# EAGLE design U WE BOX (EAGLE 9.6.2)

## Sheet 1 of 6: Power Supply Unit
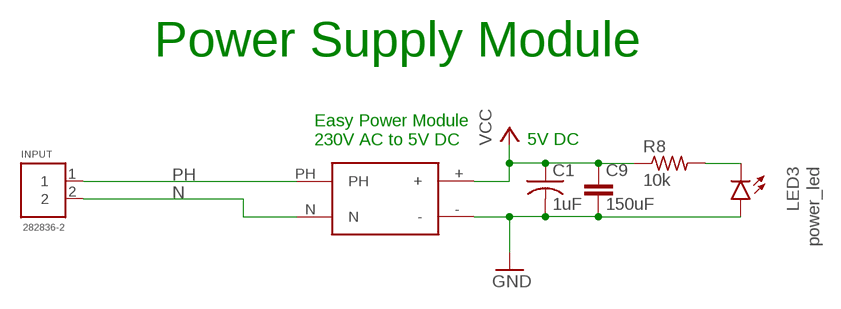
[diagram p0: schematic, sheet 1]

### Parts
C1  1uF  C-USC1206K  [C1206K]
C9  150uF  C5/5  [C5B5]
INPUT  282836-2  [CONN_282836-2]
LED3  power_led  LEDCHIPLED_1206  [CHIPLED_1206]
R8  10k  R-US_M1206  [M1206]
U2  AC/DCCONVERTER  [ACDC]

### Nets
GND: C1.2 C9.2 LED3.A U2.- ; also sheet 2,3,4,5,6
N: INPUT.2 U2.N ; also sheet 5
N$2: LED3.C R8.2
PH: INPUT.1 U2.PH ; also sheet 5
VCC: C1.1 C9.1 R8.1 U2.+ ; also sheet 2,3,4,5,6

### Notes on the sheet
- Power Supply Module
- Easy Power Module
  230V AC to 5V DC
- 5V DC

## Sheet 2 of 6: Indication LEDs
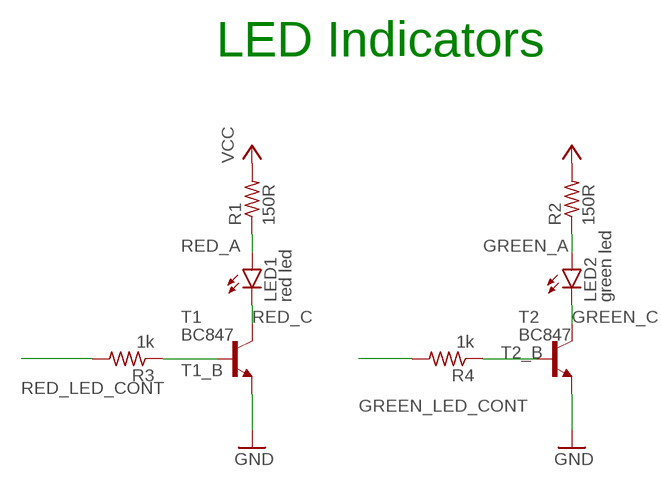
[diagram p1: schematic, sheet 2]

### Parts
LED1  red led  LEDCHIPLED_1206  [CHIPLED_1206]
LED2  green led  LEDCHIPLED_1206  [CHIPLED_1206]
R1  150R  R-US_R1206  [R1206]
R2  150R  R-US_R1206  [R1206]
R3  1k  R-US_R1206  [R1206]
R4  1k  R-US_R1206  [R1206]
T1  BC847  [SOT23]
T2  BC847  [SOT23]

### Nets
GND: T1.2(E) T2.2(E) ; also sheet 1,3,4,5,6
GREEN_A: LED2.A R2.1
GREEN_C: LED2.C T2.3(C)
GREEN_LED_CONT: R4.2 ; also sheet 6
RED_A: LED1.A R1.1
RED_C: LED1.C T1.3(C)
RED_LED_CONT: R3.2 ; also sheet 6
T1_B: R3.1 T1.1(B)
T2_B: R4.1 T2.1(B)
VCC: R1.2 R2.2 ; also sheet 1,3,4,5,6

### Notes on the sheet
- LED Indicators

## Sheet 3 of 6: Hooter System
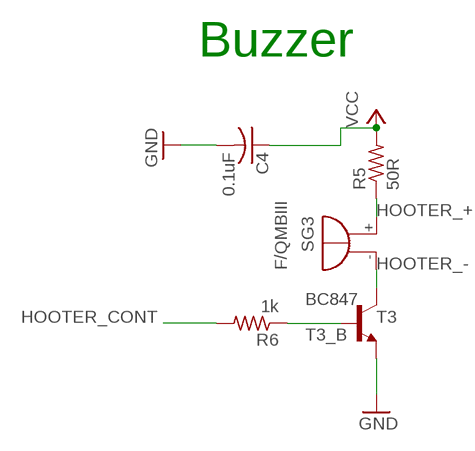
[diagram p2: schematic, sheet 3]

### Parts
C4  0.1uF  C-USC1206K  [C1206K]
R5  50R  R-US_R1206  [R1206]
R6  1k  R-US_R1206  [R1206]
SG3  F/QMBIII  [F/QMBIII]
T3  BC847  [SOT23]

### Nets
GND: C4.2 T3.2(E) ; also sheet 1,2,4,5,6
HOOTER_+: R5.1 SG3.+(-)
HOOTER_-: SG3.-(+) T3.3(C)
HOOTER_CONT: R6.2 ; also sheet 6
T3_B: R6.1 T3.1(B)
VCC: C4.1 R5.2 ; also sheet 1,2,4,5,6

### Notes on the sheet
- Buzzer

## Sheet 4 of 6: Pushbutton
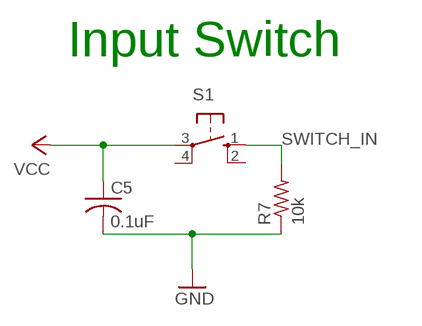
[diagram p3: schematic, sheet 4]

### Parts
C5  0.1uF  C-USC1206K  [C1206K]
R7  10k  R-US_R1206  [R1206]
S1  40-XX  [B3F-40XX]

### Nets
GND: C5.2 R7.1 ; also sheet 1,2,3,5,6
SWITCH_IN: R7.2 S1.1(S) ; also sheet 6
VCC: C5.1 S1.3(P) ; also sheet 1,2,3,5,6
Unconnected: S1.2(S1) S1.4(P1)

### Notes on the sheet
- Input Switch

## Sheet 5 of 6: Relay and Limit Switch
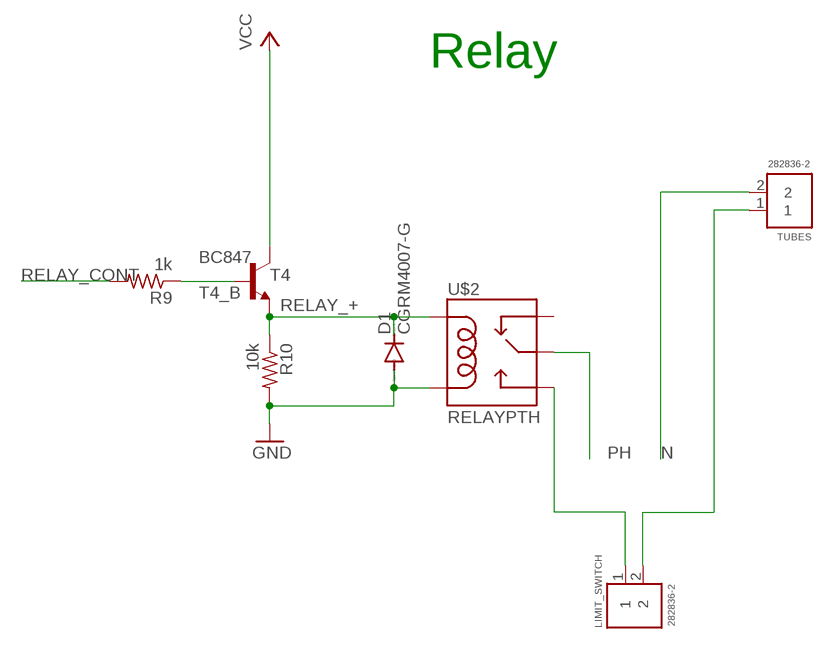
[diagram p4: schematic, sheet 5]

### Parts
D1  CGRM4007-G  [SOD-123_MINI-SMA]
LIMIT_SWITCH  282836-2  [CONN_282836-2]
R9  1k  R-US_R1206  [R1206]
R10  10k  R-US_R1206  [R1206]
T4  BC847  [SOT23]
TUBES  282836-2  [CONN_282836-2]
U$2  RELAYPTH  [SRD-05VDC-SL-C]

### Nets
GND: D1.A R10.2 U$2.COIL0 ; also sheet 1,2,3,4,6
N: TUBES.2 ; also sheet 1
PH: U$2.SWCOMMON ; also sheet 1
PH_RELAY: LIMIT_SWITCH.1 U$2.SWOPEN
RELAY_+: D1.C R10.1 T4.2(E) U$2.COIL1
RELAY_CONT: R9.2 ; also sheet 6
T4_B: R9.1 T4.1(B)
TUBE_N: LIMIT_SWITCH.2 TUBES.1
VCC: T4.3(C) ; also sheet 1,2,3,4,6
Unconnected: U$2.SWCLOSED(SWCLOSE)

### Notes on the sheet
- Relay

## Sheet 6 of 6: controller
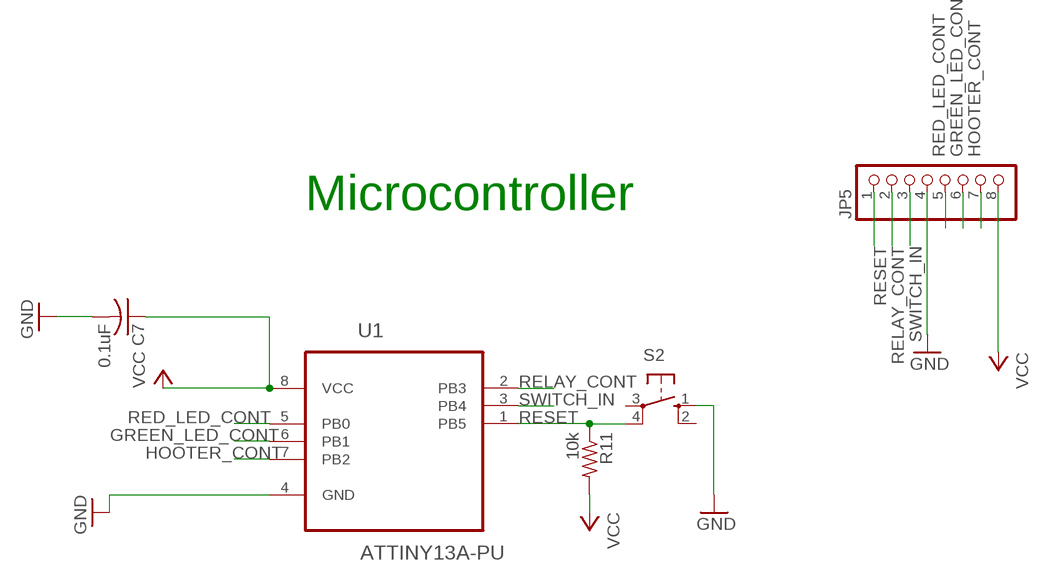
[diagram p5: schematic, sheet 6]

### Parts
C7  0.1uF  C-USC1206K  [C1206K]
JP5  PINHD-1X8  [1X08]
R11  10k  R-US_R1206  [R1206]
S2  10-XX  [B3F-10XX]
U1  ATTINY13A-PU  [DIP254P762X533-8]

### Nets
GND: C7.2 JP5.4 S2.1(S) U1.4(GND) ; also sheet 1,2,3,4,5
GREEN_LED_CONT: JP5.6 U1.6(PB1) ; also sheet 2
HOOTER_CONT: JP5.7 U1.7(PB2) ; also sheet 3
RED_LED_CONT: JP5.5 U1.5(PB0) ; also sheet 2
RELAY_CONT: JP5.2 U1.2(PB3) ; also sheet 5
RESET: JP5.1 R11.1 S2.4(P1) U1.1(PB5)
SWITCH_IN: JP5.3 U1.3(PB4) ; also sheet 4
VCC: C7.1 JP5.8 R11.2 U1.8(VCC) ; also sheet 1,2,3,4,5
Unconnected: S2.2(S1) S2.3(P)

### Notes on the sheet
- Microcontroller

## Library data of the parts
C1 C4 C5 C7 = rcl:C-US: CAPACITOR, American symbol; SPICEPREFIX: C
C9 = capacitor-wima:C: CAPACITOR naming: grid - package width
D1 = diode:CGRM400*-G: Molded plasitc,JEDEC SOD-123/Mini SMA Source: Comchip CGRM4001-G.pdf
INPUT LIMIT_SWITCH TUBES = 282836-2:282836-2: TERM BLOCK 2POS SIDE ENTRY 5MM Check prices <https://pricing.snapeda.com/parts/282836-2/TE%20Connectivity/view-part?ref=eda>; AVAILABILITY: Good; CENTERLINE_PITCH: 5 mm[.197 in]; COMMENT: 282836-2; DESCRIPTION: Connector, Terminal Block; Wire Receptacle; 2 Pos.; 16-30 AWG; 0.197 in. CL; Sid; EU_ROHS_COMPLIANCE: Compliant with Exemptions; MF: TE Connectivity; MP: 282836-2; NUMBER_OF_POSITIONS: 2; PACKAGE: None; PRICE: None; PURCHASE-URL: https://pricing.snapeda.com/search/part/282836-2/?ref=eda
JP5 = pinhead:PINHD-1X8: PIN HEADER
LED1-LED3 = led:LED: LED OSRAM: - CHIPLED LG R971, LG N971, LY N971, LG Q971, LY Q971, LO R971, LY R971 LH N974, LH R974 LS Q976, LO Q976, LY Q976 LO Q996 - Hyper CHIPLED LW Q18S LB Q993, LB Q99A, LB R99A - SideLED LS A670, LO A670, LY A670, LG A670, LP A670 LB A673, LV A673, LT A673, LW A673 LH A674 LY A675 LS A676, LA A676, LO A676, LY A676, LW A676 LS A679, LY A679, LG A679 - Hyper Micro SIDELED® LS Y876, LA Y876, LO Y876, LY Y876 LT Y87S - SmartLED LW L88C, LW L88S LB L89C, LB L89S, LG L890 LS L89K, LO L89K, LY L89K LS L896, LA L896, LO L896, LY L896 - TOPLED LS T670, LO T670, LY T670, LG T670, LP T670 LSG T670, LSP T670, LSY T670, LOP T670, LYG T670 LG T671, LOG T671, LSG T671 LB T673, LV T673, LT T673, LW T673 LH T674 LS T676, LA T676, LO T676, LY T676, LB T676, LH T676, LSB T676, LW T676 LB T67C, LV T67C, LT T67C, LS T67K, LO T67K, LY T67K, LW E67C LS E67B, LA E67B, LO E67B, LY E67B, LB E67C, LV E67C, LT E67C LW T67C LS T679, LY T679, LG T679 LS T770, LO T770, LY T770, LG T770, LP T770 LB T773, LV T773, LT T773, LW T773 LH T774 LS E675, LA E675, LY E675, LS T675 LS T776, LA T776, LO T776, LY T776, LB T776 LHGB T686 LT T68C, LB T68C - Hyper Mini TOPLED® LB M676 - Mini TOPLED Santana® LG M470 LS M47K, LO M47K, LY M47K Source: http://www.osram.convergy.de LUXEON: - LUMILED® LXK2-PW12-R00, LXK2-PW12-S00, LXK2-PW14-U00, LXK2-PW14-V00 LXK2-PM12-R00, LXK2-PM12-S00, LXK2-PM14-U00 LXK2-PE12-Q00, LXK2-PE12-R00, LXK2-PE12-S00, LXK2-PE14-T00, LXK2-PE14-U00 LXK2-PB12-K00, LXK2-PB12-L00, LXK2-PB12-M00, LXK2-PB14-N00, LXK2-PB14-P00, LXK2-PB14-Q00 LXK2-PR12-L00, LXK2-PR12-M00, LXK2-PR14-Q00, LXK2-PR14-R00 LXK2-PD12-Q00, LXK2-PD12-R00, LXK2-PD12-S00 LXK2-PH12-R00, LXK2-PH12-S00 LXK2-PL12-P00, LXK2-PL12-Q00, LXK2-PL12-R00 Source: www.luxeon.com KINGBRIGHT: KA-3528ASYC Source: www.kingbright.com
R1-R11 = rcl:R-US_: RESISTOR, American symbol; SPICEPREFIX: R
S1 = switch-omron:40-XX: OMRON SWITCH; MF: OMRON COMPONENTS USA; MPN: B3F-4000; OC_FARNELL: 176434; OC_NEWARK: 36K3105
S2 = switch-omron:10-XX: OMRON SWITCH; MPN: B3F-1000; OC_FARNELL: 176432; OC_NEWARK: 36M3542
SG3 = buzzer:F/QMBIII: BUZZER Source: Buerklin; OC_FARNELL: unknown; OC_NEWARK: unknown
T1-T4 = transistor:BC847: NPN TRANSISTOR
U1 = ATTINY13A-PU:ATTINY13A-PU: 8-bit Microcontroller with 1K Bytes In-System Programmable Flash Check prices <https://pricing.snapeda.com/parts/ATTINY13A-PU/Microchip/view-part?ref=eda>; AVAILABILITY: Good; DESCRIPTION: AVR AVR® ATtiny Microcontroller IC 8-Bit 20MHz 1KB (512 x 16) FLASH 8-PDIP; MF: Microchip; MP: ATTINY13A-PU; PACKAGE: PDIP-8 Microchip; PRICE: None; PURCHASE-URL: https://pricing.snapeda.com/search/part/ATTINY13A-PU/?ref=eda
U2 = ACDC_5V:AC/DCCONVERTER
U$2 = SRD-05VDC-SL-C:RELAY: SPDT relay (COM-00101)

## Net classes
0 default: width 0.152 mm, clearance 0.152 mm

## Board
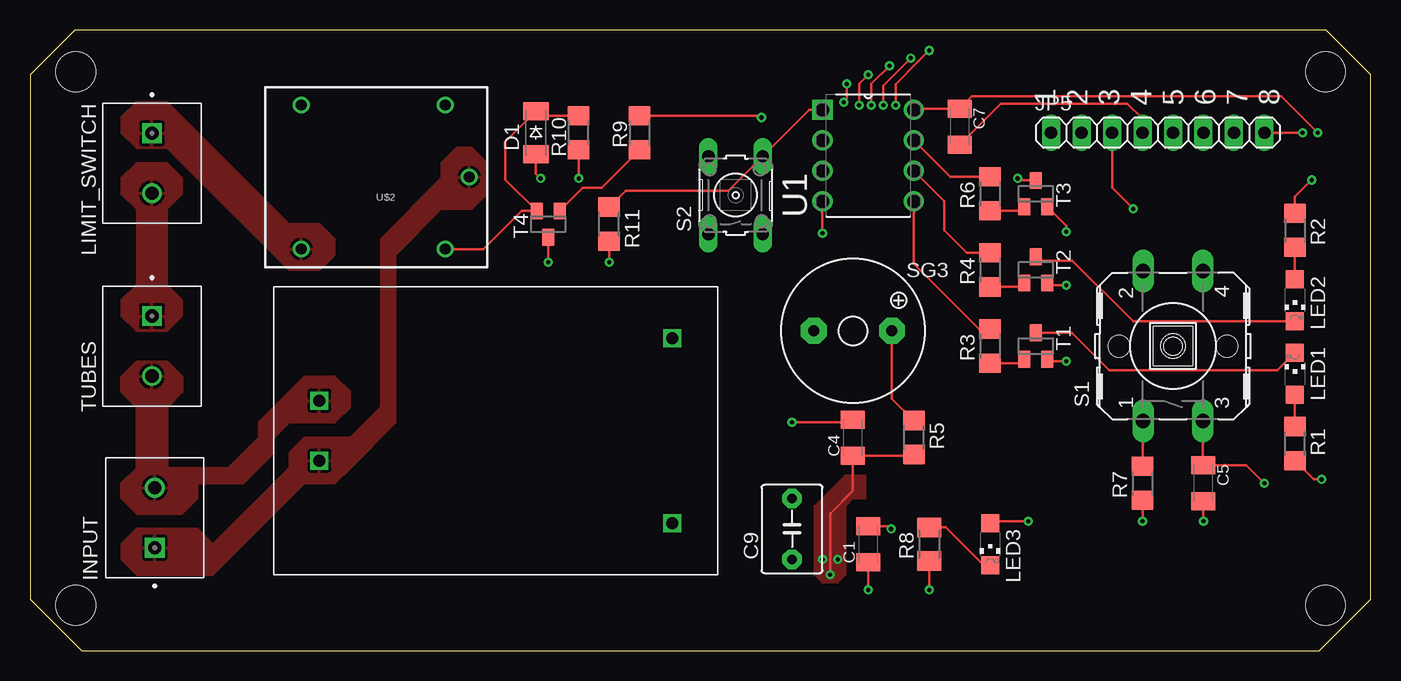
[diagram p6: board, top side]
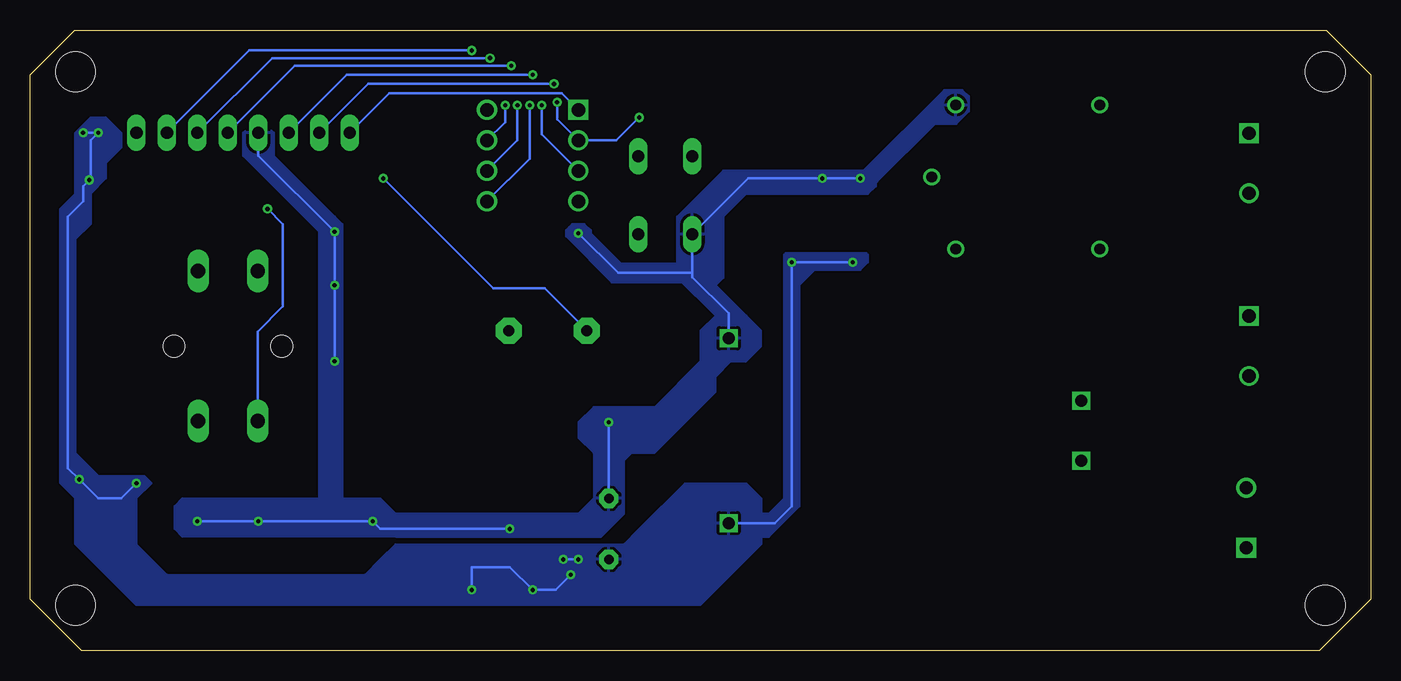
[diagram p7: board, bottom side, seen from below]

Size 111.74 x 51.74 mm. Coordinates in mm from the lower left corner, seen from the top.
Outline: 0,48.01 0,4.32 4.32,0 107.44,0 111.74,4.3 111.74,48.03 108.03,51.74 3.73,51.74 0,48.01
Copper layers (1*16): Top 0.035mm / dielectric 1.5mm / Bottom 0.035mm
Design rules "default": minimum track width 6mil, minimum drill 0.35mm, track to track 6mil, track to pad 6mil, pad to pad 6mil, via to via 6mil, smd to smd 6mil, copper to edge 40mil, drill to drill 6mil, minimum pad ring 10mil, minimum via ring 8mil, stop-mask expansion 4mil, vias tented up to drill 0mil, thermal gap 10mil
Holes 3.3 mm at 3.81,48.26 107.95,48.26 107.95,3.81 3.81,3.81

### Footprints (pad centres in the part's own frame; a part is rotated, then mirrored left to right if it is on the bottom)
C1206K = smd 1.5 x 2: 1 -1.5,0; 2 1.5,0
C5B5 = drill 0.813 pad 1.6 octagon: 1 -2.54,0; 2 2.54,0
SOD-123_MINI-SMA = smd 1.5 x 2.1: A 1.8,0; C -1.8,0
CONN_282836-2 = drill 1.1 square: 1 -2.5,0 | drill 1.1: 2 2.5,0
1X08 = drill 1.016 long: 1 -8.89,0; 2 -6.35,0; 3 -3.81,0; 4 -1.27,0; 5 1.27,0; 6 3.81,0; 7 6.35,0; 8 8.89,0
CHIPLED_1206 = smd 1.5 x 1.5: A 0,-1.75; C 0,1.75
R1206 = smd 1.6 x 1.803: 1 -1.422,0; 2 1.422,0
M1206 = smd 1.6 x 2: 1 -1.4,0; 2 1.4,0
B3F-40XX = drill 1.194 long: 1 -6.248,2.489; 2 6.248,2.489; 3 -6.248,-2.489; 4 6.248,-2.489 | hole 1.803: 0,-4.496; 0,4.496
B3F-10XX = drill 1.016 long: 1 -3.251,2.261; 2 3.251,2.261; 3 -3.251,-2.261; 4 3.251,-2.261
F/QMBIII = drill 0.914 pad 2.159 octagon: + 3.251,0; - -3.251,0
SOT23 = smd 1 x 1.4: 1 -0.95,-1.1; 2 0.95,-1.1; 3 0,1.1
DIP254P762X533-8 = drill 1.118 square: 1 -7.62,7.62 | drill 1.118: 2 -7.62,5.08; 3 -7.62,2.54; 4 -7.62,0; 5 0,0; 6 0,2.54; 7 0,5.08; 8 0,7.62
ACDC = drill 1 square: + 33.2,4.3; - 33.2,19.7; N 3.8,14.5; PH 3.8,9.5
SRD-05VDC-SL-C = drill 0.9: COIL0 -5.39,-6.12; COIL1 -5.39,5.88; SWCLOSED 6.61,-6.12; SWCOMMON -7.39,-0.12; SWOPEN 6.61,5.88

### Placement (x,y rotation side)
C1  69.85,8.89 90 top
C4  68.58,17.78 90 top
C5  97.79,13.97 270 top
C7  77.47,43.69 270 top
C9  63.5,10.16 90 top
D1  42.16,43.18 270 top
INPUT  10.39,11.1 90 top
JP5  93.98,43.18 0 top
LED1  105.41,23.11 0 top
LED2  105.41,29.21 180 top
LED3  80.01,8.89 180 top
LIMIT_SWITCH  10.16,40.64 270 top
R1  105.41,17.27 270 top
R2  105.41,35.05 90 top
R3  80.01,25.4 90 top
R4  80.01,31.75 90 top
R5  73.66,17.78 270 top
R6  80.01,38.1 90 top
R7  92.71,13.97 90 top
R8  74.93,8.89 90 top
R9  50.8,43.18 90 top
R10  45.72,43.18 270 top
R11  48.26,35.56 270 top
S1  95.25,25.4 90 top
S2  58.8,37.97 90 top
SG3  68.58,26.67 0 top
T1  83.82,25.4 0 top
T2  83.82,31.75 0 top
T3  83.82,38.1 0 top
T4  43.18,35.56 180 top
TUBES  10.16,25.4 270 top
U1  73.66,37.47 0 top
U2  20.32,6.35 0 top
U$2  29.21,39.37 180 top

### Tracks (layer width: path | path; a pad name or v marks a point on that pad's centre or on a via)
GND  (via drill 0.35)
  Top 0.203: R7.1 v92.71,10.79 | v97.79,10.79 C5.2 | LED3.A 80.17,10.79 v83.19,10.79 | C1.2 71.53,10.39 v71.75,10.16 | C4.2 68.35,19.05 v63.5,19.05 | T3.2 86.36,35.41 v86.36,34.92 | v86.36,30.48 84.94,30.48 T2.2 | T1.2 84.94,24.13 v86.36,24.13 | C7.2 80.88,45.59 91.44,45.59 92.71,44.32 JP5.4 | v45.72,39.37 R10.2 | v42.55,39.37 42.16,39.75 D1.A | U1.4 v66.04,34.8
  Bottom 0.203: v97.79,10.79 v92.71,10.79 v83.19,10.79 82.55,10.16 v71.75,10.16 | v63.5,19.05 C9.2 | v86.36,24.13 v86.36,30.48 v86.36,34.92 92.71,41.27 JP5.4 | U2.- 53.52,28.12 56.54,31.14 56.54,31.5 | 56.54,31.5 S2.1 51.89,39.37 v45.72,39.37 v42.55,39.37 | v66.04,34.8 62.74,31.5 56.54,31.5
  pour Bottom: 52.07,27.94 54.61,27.94 55.88,26.67 55.88,25.4 55.88,24.13 59.69,20.32 64.77,20.32 66.04,19.05 66.04,17.78 64.77,16.51 59.69,16.51 54.61,21.59 54.61,22.86 53.34,24.13 52.07,24.13 50.8,25.4 50.8,26.67
  pour Bottom: 62.23,17.78 63.5,17.78 64.77,16.51 64.77,12.7 66.04,11.43 81.28,11.43 81.92,10.79 81.92,10.16 81.28,9.53 64.14,9.53 62.23,11.43 62.23,15.88 61.59,16.51 61.59,17.14
  pour Bottom: 81.28,11.43 80.64,10.79 80.64,10.16 81.28,9.53 99.06,9.53 99.69,10.16 99.69,12.06 99.06,12.7 82.55,12.7
  pour Bottom: 87.63,11.43 86.36,11.43 85.72,12.06 85.72,35.56 86.36,36.2 87,36.2 87.63,35.56
  pour Bottom: 92.08,43.81 93.34,43.81 93.98,43.18 93.98,41.27 87.63,34.92 87,34.92 86.36,34.92 85.72,35.56 86.36,36.2 91.44,41.27 91.44,41.91 91.44,43.18
  pour Bottom: 52.07,27.94 52.7,27.3 53.98,27.3 54.61,27.94 57.78,31.11 57.78,36.2 53.98,40.01 41.91,40.01 41.27,39.37 41.27,38.73 41.91,38.1 52.07,38.1 55.88,34.29 55.88,31.75
  pour Bottom: 53.98,36.2 53.98,31.11 54.61,30.48 55.24,30.48 55.88,31.11 55.88,35.56 55.24,36.2
  pour Bottom: 56.64,32.26 56.64,31.5 57.4,30.73 63.25,30.73 67.06,34.54 67.06,35.05 66.8,35.31 66.55,35.56 65.53,35.56 65.02,35.05 65.02,34.8 62.48,32.26 56.9,32.26
  pour Bottom: 41.15,39.12 36.32,43.94 34.54,43.94 33.53,44.96 33.53,45.21 33.53,46.23 34.04,46.74 34.29,46.74 35.56,46.74 42.42,39.88 42.42,39.12 42.16,38.86 41.4,38.86
GREEN_A
  Top 0.203: R2.1 LED2.A
GREEN_C
  Top 0.203: T2.3 84.16,32.51 86.87,32.51 91.92,27.46 LED2.C
GREEN_LED_CONT  (via drill 0.35)
  Top 0.203: U1.6 76.2,37.47 76.2,35.05 78.08,33.17 R4.2 | v71.12,45.47 71.12,47.11 v73.41,49.4
  Bottom 0.203: U1.6 71.12,42.55 v71.12,45.47 | v73.41,49.4 91.57,49.4 JP5.6
HOOTER_+
  Top 0.203: R5.1 71.83,21.03 SG3.+
HOOTER_-  (via drill 0.35)
  Top 0.203: T3.3 82.47,39.2 v82.3,39.37
  Bottom 0.203: v82.3,39.37 73.15,30.23 68.83,30.23 65.33,26.72 SG3.-
HOOTER_CONT  (via drill 0.35)
  Top 0.203: U1.7 76.68,39.52 R6.2 | v74.93,50.03 74.04,49.14 72.14,47.24 v72.14,45.47
  Bottom 0.203: U1.7 72.14,44.07 v72.14,45.47 | v74.93,50.03 93.48,50.03 JP5.7
N
  pour Top: 10.16,11.43 12.7,11.43 13.97,12.7 13.97,13.97 17.78,13.97 20.32,16.51 20.32,17.78 21.59,19.05 25.4,19.05 26.67,20.32 26.67,21.59 25.4,22.86 22.86,22.86 19.05,19.05 19.05,17.78 16.51,15.24 8.89,15.24 7.62,13.97 7.62,12.7 8.89,11.43
  pour Top: 8.89,11.43 7.62,12.7 7.62,13.97 8.89,15.24 8.89,20.32 7.62,21.59 7.62,22.86 8.89,24.13 11.43,24.13 12.7,22.86 12.7,21.59 11.43,20.32 11.43,15.24 12.7,13.97 12.7,12.7 11.43,11.43
N$2
  Top 0.203: R8.2 76.32,10.29 79.47,7.14 LED3.C
PH
  pour Top: 10.16,10.16 8.89,10.16 7.62,8.89 7.62,7.62 8.89,6.35 15.24,6.35 16.51,7.62 22.86,13.97 24.13,13.97 25.4,13.97 26.67,15.24 26.67,16.51 25.4,17.78 22.86,17.78 21.59,16.51 21.59,15.24 15.24,8.89 13.97,10.16
  pour Top: 21.59,15.24 22.86,13.97 25.4,13.97 26.67,15.24 30.48,19.05 30.48,22.86 30.48,33.02 34.29,36.83 36.83,36.83 38.1,38.1 38.1,40.64 36.83,41.91 35.56,41.91 34.29,40.64 34.29,39.37 29.21,34.29 29.21,20.32 26.67,17.78 25.4,17.78 22.86,17.78 21.59,16.51
PH_RELAY
  pour Top: 10.16,41.91 11.43,41.91 12.7,40.64 21.59,31.75 24.13,31.75 25.4,33.02 25.4,34.29 24.13,35.56 21.59,35.56 11.43,45.72 8.89,45.72 7.62,44.45 7.62,43.18 8.89,41.91
RED_A
  Top 0.203: R1.1 LED1.A
RED_C
  Top 0.203: T1.3 86.8,26.5 89.92,23.38 103.93,23.38 LED1.C
RED_LED_CONT  (via drill 0.35)
  Top 0.203: U1.5 73.66,32.26 79.1,26.82 R3.2 | v70.1,45.47 70.1,47.24 v71.63,48.77
  Bottom 0.203: U1.5 70.1,41.02 v70.1,45.47 | v71.63,48.77 89.66,48.77 JP5.5
RELAY_+
  Top 0.203: U$2.COIL1 37.79,33.49 40.96,36.66 T4.2 39.62,39.27 39.62,42.42 42.16,44.96 D1.C 42.54,44.6 R10.1
RELAY_CONT  (via drill 0.35)
  Top 0.203: R9.2 60.81,44.6 v60.96,44.45 | v67.82,45.72 68.07,45.97 v68.07,47.24
  Bottom 0.203: v60.96,44.45 62.87,42.55 U1.2 67.82,44.32 v67.82,45.72 | v68.07,47.24 83.57,47.24 JP5.2
RESET
  Top 0.203: R11.1 49.63,38.35 58.19,38.35 S2.4 64.92,45.09 U1.1
  Bottom 0.203: U1.1 67.44,46.48 81.79,46.48 JP5.1
SWITCH_IN  (via drill 0.35)
  Top 0.203: R7.2 92.71,19.1 S1.1 | v91.95,36.83 90.17,38.61 JP5.3 | v69.09,45.47 69.09,47.24 v69.85,48.01
  Bottom 0.203: S1.1 92.76,24.55 92.77,24.56 92.77,26.61 90.68,28.7 90.68,35.56 v91.95,36.83 | U1.3 69.09,43.05 v69.09,45.47 | v69.85,48.01 85.34,48.01 JP5.3
T1_B
  Top 0.203: R3.1 82.55,23.98 T1.1
T2_B
  Top 0.203: R4.1 82.55,30.33 T2.1
T3_B
  Top 0.203: R6.1 82.55,36.68 T3.1
T4_B
  Top 0.203: T4.1 46.08,38.61 47.65,38.61 R9.1
TUBE_N
  pour Top: 10.16,26.67 11.43,26.67 12.7,27.94 12.7,29.21 11.43,30.48 11.43,36.83 12.7,38.1 12.7,39.37 11.43,40.64 8.89,40.64 7.62,39.37 7.62,38.1 8.89,36.83 8.89,30.48 7.62,29.21 7.62,27.94 8.89,26.67
VCC  (via drill 0.35)
  Top 0.203: JP5.8 v106.05,43.18 | v102.87,13.97 101.37,15.47 C5.1 97.74,15.52 S1.3 | C1.1 v69.85,5.08 | v74.93,5.08 R8.1 | v66.67,6.35 66.67,11.43 68.58,13.34 C4.1 73.58,16.28 R5.2 | v107.31,43.18 104.29,46.2 78.49,46.2 C7.1 73.76,45.19 U1.8 | T4.3 v43.18,32.38 | v48.26,32.38 R11.2 | R1.2 106.97,14.29 v107.63,14.29 | R2.2 105.41,37.85 v106.81,39.24
  Bottom 0.203: v102.87,13.97 104.14,12.7 106.05,12.7 v107.63,14.29 108.58,15.24 108.58,36.2 107.31,37.47 107.31,38.73 v106.81,39.24 106.68,39.37 106.68,42.55 v106.05,43.18 v107.31,43.18 | v74.93,5.08 74.93,6.99 71.75,6.99 v69.85,5.08 67.94,5.08 v66.67,6.35 | v66.04,7.62 v67.31,7.62 | v43.18,32.38 v48.26,32.38 48.26,12.06 49.67,10.65 U2.+
  pour Bottom: 50.8,8.89 55.88,3.81 80.01,3.81 82.55,6.35 82.55,7.62 81.28,8.89 62.23,8.89 60.96,10.16 57.15,13.97 55.88,13.97 52.07,13.97 50.8,12.7
  pour Bottom: 77.47,6.35 77.47,5.08 78.74,3.81 102.87,3.81 107.95,8.89 107.95,13.97 107.31,14.61 102.23,14.61 101.6,13.97 102.87,12.7 102.87,8.89 100.33,6.35 83.82,6.35 82.55,7.62 78.74,7.62
  pour Bottom: 105.41,13.97 106.68,12.7 107.95,12.7 109.22,13.97 109.22,36.83 107.95,38.1 106.68,38.1 106.68,35.56 107.95,34.29 107.95,16.51
  pour Bottom: 107.95,38.1 107.95,43.18 106.68,44.45 105.41,44.45 104.14,43.18 104.14,41.91 105.41,40.64 105.41,39.37 106.68,38.1 106.68,36.83
  pour Top: 65.41,12.06 65.41,6.35 66.04,5.71 67.31,5.71 67.94,6.35 67.94,12.06 68.58,12.7 69.6,12.7 69.6,14.61 67.94,14.61
  pour Bottom: 46.35,31.75 42.55,31.75 41.91,32.38 41.91,33.02 42.04,33.15 48.77,33.15 48.9,33.02 48.9,12.7 50.16,11.43 51.44,11.43 52.07,10.79 51.44,10.16 51.44,9.53 50.16,9.53 47.62,12.06 47.62,30.48

### Text on the board
_tNames: 1 / 2 / 3 / 4 / 5 / 6 / 7 / 8